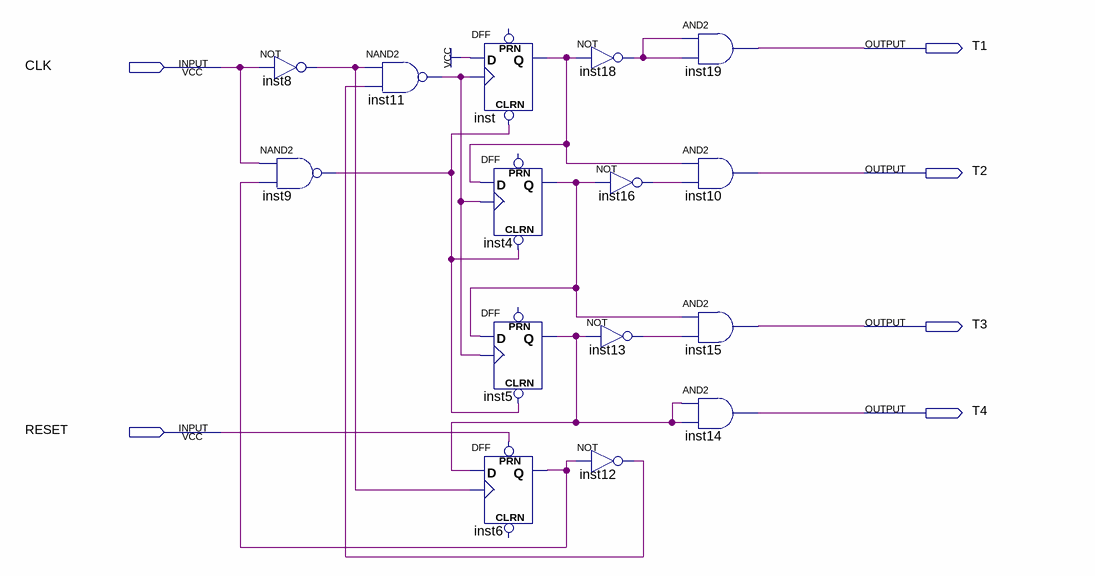
[diagram p0: schematic sheet]
// Quartus schematic CPU_4T_origin.bdf as structural Verilog: 15 symbols, 6 pins
module CPU_4T_origin (
  input  CLK,
  input  RESET,
  output T1,
  output T2,
  output T3,
  output T4
);

  wire inst4_q, inst5_q, inst6_q, inst8_out, inst9_out, inst11_out, inst12_out, inst13_out, inst16_out,
       inst18_out, inst_q;

  not inst8 (inst8_out, CLK);
  nand inst9 (inst9_out, CLK, inst6_q);
  nand inst11 (inst11_out, inst8_out, inst12_out);
  DFF inst (.CLRN(inst9_out), .CLK(inst11_out), .D(1'b1), .Q(inst_q));  // open: PRN
  DFF inst4 (.CLRN(inst9_out), .CLK(inst11_out), .D(inst_q), .Q(inst4_q));  // open: PRN
  DFF inst5 (.CLRN(inst9_out), .CLK(inst11_out), .D(inst4_q), .Q(inst5_q));  // open: PRN
  DFF inst6 (.CLK(inst8_out), .D(inst5_q), .PRN(RESET), .Q(inst6_q));  // open: CLRN
  not inst18 (inst18_out, inst_q);
  not inst16 (inst16_out, inst4_q);
  not inst13 (inst13_out, inst5_q);
  not inst12 (inst12_out, inst6_q);
  and inst19 (T1, inst18_out, inst18_out);
  and inst10 (T2, inst_q, inst16_out);
  and inst15 (T3, inst4_q, inst13_out);
  and inst14 (T4, inst5_q, inst5_q);
endmodule
